# Altium schematic sheet ESP8266.SchDoc
size A
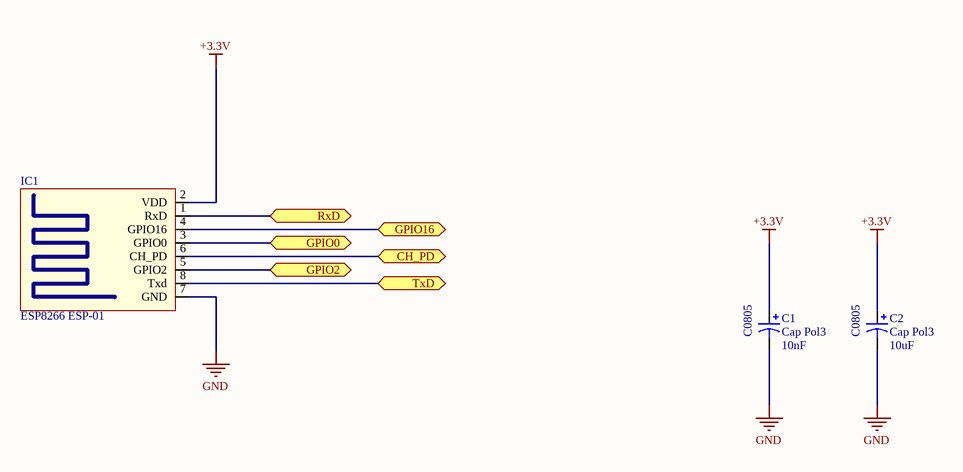
[diagram p0: ESP8266.SchDoc]

## Parts
C1  Cap Pol3  value 10nF  [C0805]
C2  Cap Pol3  value 10uF  [C0805]
IC1  ESP8266 ESP-01  [ESP8266 ESP-01]

## Ports
CH_PD, GPIO0, GPIO2, GPIO16, RxD, TxD

## Nets
+3.3V: C1.1 C2.1 IC1.2(VDD)
GND: C1.2 C2.2 IC1.7(GND)
CH_PD: IC1.6(CH_PD) ; port CH_PD
GPIO0: IC1.3(GPIO0) ; port GPIO0
GPIO2: IC1.5(GPIO2) ; port GPIO2
GPIO16: IC1.4(GPIO16) ; port GPIO16
RxD: IC1.1(RxD) ; port RxD
TxD: IC1.8(Txd) ; port TxD

## Library data of the parts
C1 C2 = Cap Pol3: Polarized Capacitor (Surface Mount); Published: 8-Jun-2000; LatestRevisionDate: 29-May-2009; LatestRevisionNote: IPC-7351 Footprint Added.; PackageReference: C0805; Publisher: Altium Limited; PackageDescription: Chip Capacitor